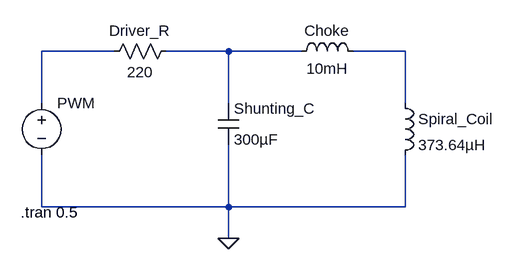
[diagram p0: schematic Low-pass filter.asc]
Low-pass filter.asc, the LTspice schematic file:
Version 4
SHEET 1 880 680
WIRE 272 -384 160 -384
WIRE 448 -384 352 -384
WIRE 560 -384 448 -384
WIRE 720 -384 640 -384
WIRE 160 -304 160 -384
WIRE 448 -304 448 -384
WIRE 720 -304 720 -384
WIRE 160 -144 160 -224
WIRE 448 -144 448 -240
WIRE 448 -144 160 -144
WIRE 720 -144 720 -224
WIRE 720 -144 448 -144
WIRE 448 -96 448 -144
FLAG 448 -96 0
SYMBOL voltage 160 -320 R0
WINDOW 3 24 96 Invisible 2
WINDOW 123 0 0 Left 0
WINDOW 39 0 0 Left 0
SYMATTR Value PULSE(0 5 0 0 0 0.0006 0.000625 1000)
SYMATTR InstName PWM
SYMBOL res 368 -400 R90
WINDOW 0 0 56 VBottom 2
WINDOW 3 32 56 VTop 2
SYMATTR InstName Driver_R
SYMATTR Value 220
SYMBOL cap 432 -304 R0
SYMATTR InstName Shunting_C
SYMATTR Value 300µF
SYMATTR SpiceLine V=10
SYMBOL ind 704 -320 R0
SYMATTR InstName Spiral_Coil
SYMATTR Value 373.64µH
SYMATTR SpiceLine Rser=25.14 Cpar=800nF
SYMBOL ind 544 -368 R270
WINDOW 0 32 56 VTop 2
WINDOW 3 5 56 VBottom 2
SYMATTR InstName Choke
SYMATTR Value 10mH
SYMATTR SpiceLine Rser=10.3
TEXT 128 -136 Left 2 !.tran 0.5

The netlist it stands for:
* Low-pass filter.asc
V§PWM N001 0 PULSE(0 5 0 0 0 0.0006 0.000625 1000)
R§Driver_R N002 N001 220
C§Shunting_C N002 0 300µF V=10
L§Spiral_Coil N003 0 373.64µH Rser=25.14 Cpar=800nF
L§Choke N002 N003 10mH Rser=10.3
.tran 0.5
.backanno
.end